# EAGLE schematic li-charger (EAGLE 9.2.2)
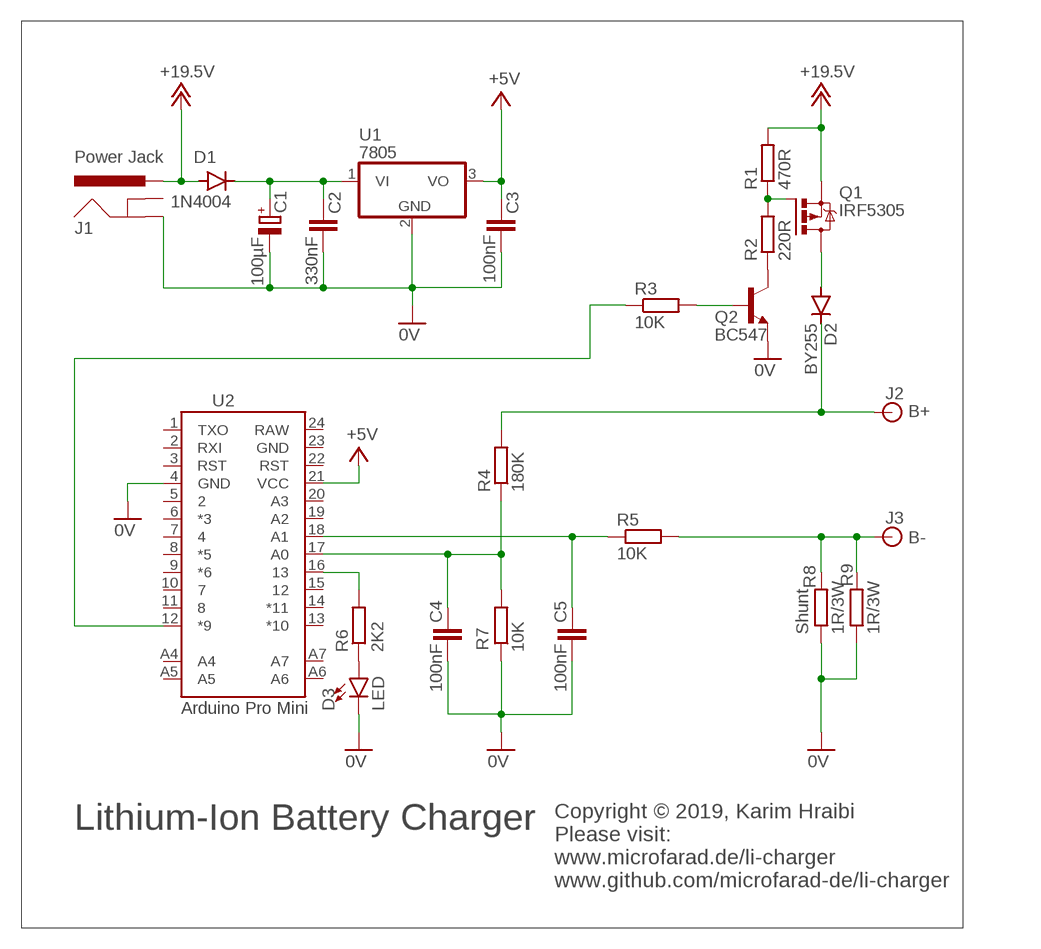
[diagram p0: schematic, sheet 1]

## Parts
C1  100µF  CPOL-EUE2.5-5  [E2,5-5]
C2  330nF  C-EU025-040X050  [C025-040X050]
C3  100nF  C-EU025-040X050  [C025-040X050]
C4  100nF  C-EU025-040X050  [C025-040X050]
C5  100nF  C-EU025-040X050  [C025-040X050]
D1  1N4004  [DO41-10]
D2  BY255  BY251  [DO201-15]
D3  LED  LED5MM  [LED_5MM]
J1  Power Jack  POWER_JACKPTH_BREAD  [POWER_JACK_PTH_BREAD]
J2  BANANA_CONN  [BANANA_CONN]
J3  BANANA_CONN  [BANANA_CONN]
Q1  IRF5305  [TO220V]
Q2  BC547  [TO92]
R1  470R  R-EU_0207/10  [0207/10]
R2  220R  R-EU_0207/10  [0207/10]
R3  10K  R-EU_0207/10  [0207/10]
R4  180K  R-EU_0207/10  [0207/10]
R5  10K  R-EU_0207/10  [0207/10]
R6  2K2  R-EU_0207/7  [0207/7]
R7  10K  R-EU_0207/10  [0207/10]
R8  1R/3W  R-EU_0617/22  [0617/22]
R9  1R/3W  R-EU_0617/22  [0617/22]
U1  7805  7805TV  [TO220V]
U2  Arduino Pro Mini  ARDUINO_PRO_MINI_TS  [ARDUINO_PRO_MINI_TS]

## Nets
0V: C1.- C2.2 C3.2 C4.2 C5.2 D3.K(C) J1.GND Q2.1(E) R7.1 R8.1 R9.1 U1.2(GND) U2.4(GND)
+5V: C3.1 U1.3(VO) U2.21(VCC)
+19V: D1.A J1.PWR ; supply symbol labelled +19.5V
+29V: Q1.3(S$1) R1.2 ; supply symbol labelled +19.5V
B+: D2.C J2.P$1 R4.2
B-: J3.P$1 R5.2 R8.2 R9.2
N$1: Q1.1(G$1) R1.1 R2.2
N$2: Q2.2(B) R3.2
N$3: R3.1 U2.12(*9)
N$4: Q2.3(C) R2.1
N$5: D2.A Q1.2(D$1)
N$6: C1.+ C2.1 D1.C U1.1(VI)
N$10: C4.1 R4.1 R7.2 U2.17(A0)
N$11: D3.A R6.1
N$12: R6.2 U2.16
N$13: C5.1 R5.1 U2.18(A1)
Unconnected: J1.GNDBREAK U2.1(TXO) U2.2(RXI) U2.3(RST) U2.5 U2.6(*3) U2.7 U2.8(*5) U2.9(*6) U2.10 U2.11 U2.13(*10) U2.14(*11) U2.15 U2.19(A2) U2.20(A3) U2.22(RST) U2.A4 U2.A5 U2.A6 U2.A7

## Notes on the sheet
- Shunt
- Lithium-Ion Battery Charger
- Copyright © 2019, Karim Hraibi
  Please visit:
  www.microfarad.de/li-charger
  www.github.com/microfarad-de/li-charger

## Power pins joined to a net without a drawn wire
GND: U2.23(GND)
RAW: U2.24(RAW)

## Library data of the parts
C1 = rcl:CPOL-EU: POLARIZED CAPACITOR, European symbol; SPICEPREFIX: C
C2-C5 = rcl:C-EU: CAPACITOR, European symbol; SPICEPREFIX: C
D1 = diode:1N4004: DIODE general purpose rectifier, 1 A
D2 = diode:BY251: DIODE Si, 200 V, 3 A
D3 = SparkFun-LED:LED: LED (Generic) Standard schematic elements and footprints for 5mm, 3mm, 1206, and 0603 sized LEDs. Generic LEDs with no color specified.
J1 = SparkFun-Connectors:POWER_JACK: Power Jack Connector This is the standard 5.5mm barrel jack for power. The PTH is the most common, proven, reliable, footprint. The Slot footprint only works if the mill layer is transmitted to the PCB fab house so be warned. Here are the connectors we sell at SparkFun: DC Barrel Power Jack/Connector <https://www.sparkfun.com/products/119> (PRT-00119) DC Barrel Power Jack/Connector (SMD) <https://www.sparkfun.com/products/12748> (PRT-12748) DC Barrel Jack Adapter - Breadboard Compatible <https://www.sparkfun.com/products/10811> (PRT-10811) It is used on this SparkFun product (and many, many others): SparkFun RedBoard - Programmed with Arduino <https://www.sparkfun.com/products/12757> (DEV-12757) Also, if you need a mating power supply or connector, please check these out: Wall Adapter Power Supply - 9VDC 650mA <https://www.sparkfun.com/products/298> (TOL-00298) DC Barrel Jack Adapter - Male <https://www.sparkfun.com/products/10287> (PRT-10287); PROD_ID: PRT-10811
J2 J3 = SparkFun-Connectors:BANANA_CONN: Through-hole Banana Jack Basic PTH connection for banana jack plugs SparkFun Products: Multimeter Kit <https://www.sparkfun.com/products/retired/10956> Banana to Alligator Cable <https://www.sparkfun.com/products/retired/509> Banana to Alligator Coax Cable <https://www.sparkfun.com/products/retired/508> Banana to Banana Cable <https://www.sparkfun.com/products/retired/507> Banana to IC Hook Cables <https://www.sparkfun.com/products/retired/506>
Q1 = microfarad-de:IRF5305: IRF5305 HEXFET® Power MOSFET P-Channel MOSFET: VDSS = -55V RDS(on) = 0.06Ω ID = -31A
Q2 = transistor-npn:BC547*: NPN Transistor
R1-R9 = rcl:R-EU_: RESISTOR, European symbol; SPICEPREFIX: R
U1 = linear:78*: Positive VOLTAGE REGULATOR Source: http://cache.national.com/ds/LM/LM78L05.pdf http://www.fairchildsemi.com/ds/LM/LM7805.pdf
U2 = microfarad-de:ARDUINO_PRO_MINI: Arduino Pro Mini Arduino Pro Mini compatible devices. Variants: Original "The Simple" clone (TS)